# EAGLE design Loginator (EAGLE 6.2)
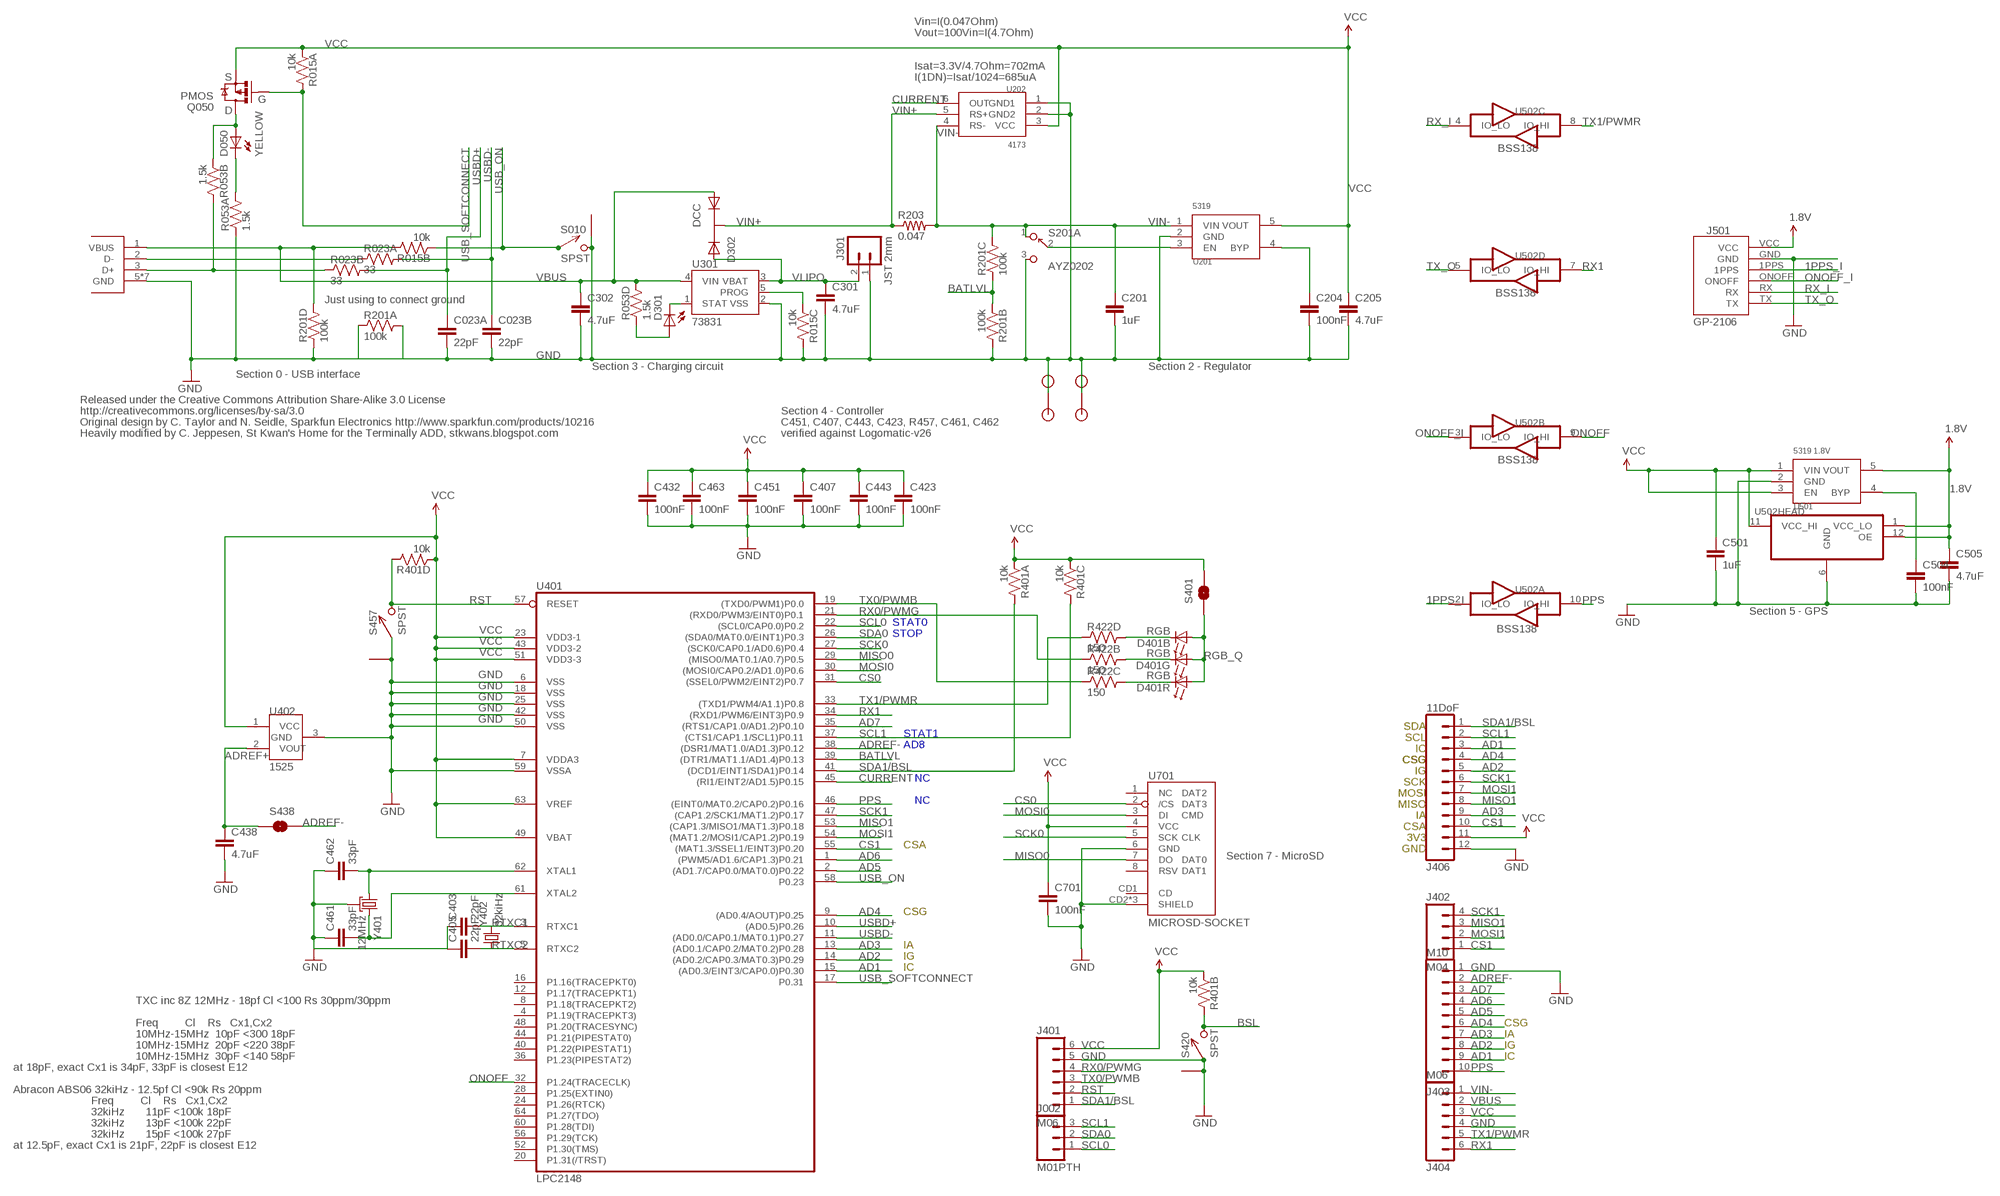
[diagram p0: schematic, sheet 1]

## Parts
C023  22pF  CKCM25  [CKCM25]
C201  1uF  CAP0402-CAP  [0402-CAP]
C204  100nF  CAP0402-CAP  [0402-CAP]
C205  4.7uF  CAP0402-CAP  [0402-CAP]
C301  4.7uF  CAP0402-CAP  [0402-CAP]
C302  4.7uF  CAP0402-CAP  [0402-CAP]
C403  22pF  CAP0402-CAP  [0402-CAP]
C405  22pF  CAP0402-CAP  [0402-CAP]
C407  100nF  CAP0402-CAP  [0402-CAP]
C423  100nF  CAP0402-CAP  [0402-CAP]
C432  100nF  CAP0402-CAP  [0402-CAP]
C438  4.7uF  CAP0402-CAP  [0402-CAP]
C443  100nF  CAP0402-CAP  [0402-CAP]
C451  100nF  CAP0402-CAP  [0402-CAP]
C461  33pF  CAP0402-CAP  [0402-CAP]
C462  33pF  CAP0402-CAP  [0402-CAP]
C463  100nF  CAP0402-CAP  [0402-CAP]
C501  1uF  CAP0402-CAP  [0402-CAP]
C504  100nF  CAP0402-CAP  [0402-CAP]
C505  4.7uF  CAP0402-CAP  [0402-CAP]
C701  100nF  CAP0402-CAP  [0402-CAP]
D050  YELLOW  LED0603  [LED-0603]
D301  BLUE  LED0603  [LED-0603]
D302  DCC  PMEG2005CT  [SOT-23-3]
D401  RGB  SMLP36RGB2W(R)  [SMLP36]
J001  USB_MICROB_JSTGCT  [USB_MICROB_3075]
J002  M01PTH  M03PTH  [1X03]
J301  JST 2mm  M02-JST-2MM-SMT  [JST-2-SMD]
J401  M06  M06SIP  [1X06]
J402  M04  M04PTH  [1X04]
J403  M10  M10"  [1X10]
J404  M06  M06SIP  [1X06]
J406  11DoF  M12PTH  [1X12]
J501  GP-2106  [GP-2106]
JP1  STANDOFF  [STANDOFF]
JP2  STANDOFF  [STANDOFF]
JP3  STANDOFF  [STANDOFF]
JP4  STANDOFF  [STANDOFF]
Q050  PMOS  MOSFET-PCHANNELSMD  [SOT23-3]
R015  10k  RP404  [CRA04]
R023  33  RP2EXB24V  [CRA02]
R053  1.5k  RP404  [CRA04]
R201  100k  RP404  [CRA04]
R203  0.047  RESISTOR0402-RES  [0402-RES]
R401  10k  RP404  [CRA04]
R422  150  RP404  [CRA04]
S010  SPST  B3U-1100P  [B3U-1100P]
S201  AYZ0202  [AYZ0202]
S401  SOLDERJUMPERNO  [SJ_2S-NO]
S420  SPST  B3U-1100P  [B3U-1100P]
S438  SOLDERJUMPERNO  [SJ_2S-NO]
S457  SPST  B3U-1100P  [B3U-1100P]
U201  5319  MIC5319D5  [SOT-23-5]
U202  4173  MAX4173  [SOT-23-6]
U301  73831  MCP73831  [SOT23-5]
U401  LPC2148  LPC213X  [SQFP-S-10X10-64]
U402  1525  MCP1525  [SOT-23-3]
U501  5319 1.8V  MIC5319D5  [SOT-23-5]
U502  TXB0104RUT  [R-PUQFN-N12]
U701  MICROSD-SOCKET  [MICROSD-SOCKET-PP]
Y401  12MHz  CX2520  [CRYSTAL_SMD_2MM_2_5MM]
Y402  32kiHz  ABS06  [ABS06]

## Nets
1.8V: C505.1 J501.VCC U501.5(VOUT) U502.1(HEAD:VCC_LO) U502.12(HEAD:OE)
1PPS_I: J501.1PPS U502.2(A:IO_LO)
AD1: J403.9 J406.3 U401.15((AD0.3/EINT3/CAP0.0)P0.30)
AD2: J403.8 J406.5 U401.14((AD0.2/CAP0.3/MAT0.3)P0.29)
AD3: J403.7 J406.9 U401.13((AD0.1/CAP0.2/MAT0.2)P0.28)
AD4: J403.6 J406.4 U401.9((AD0.4/AOUT)P0.25)
AD5: J403.5 U401.2((AD1.7/CAP0.0/MAT0.0)P0.22)
AD6: J403.4 U401.1((PWM5/AD1.6/CAP1.3)P0.21)
AD7: J403.3 U401.35((RTS1/CAP1.0/AD1.2)P0.10)
ADREF+: C438.1 S438.1 U402.2(VOUT)
ADREF-: J403.2 S438.2 U401.38((DSR1/MAT1.0/AD1.3)P0.12)
BATLVL: R201.2 R201.3 U401.39((DTR1/MAT1.1/AD1.4)P0.13)
BSL: R401.7 S420.P$2
CONN_D+: J001.3(D+) R023.2 R053.7
CONN_D-: J001.2(D-) R023.1
CS0: U401.31((SSEL0/PWM2/EINT2)P0.7) U701.2(/CS)
CS1: J402.1 J406.10 U401.55((MAT1.3/SSEL1/EINT3)P0.20)
CURRENT: U202.6(OUT) U401.45((RI1/EINT2/AD1.5)P0.15)
DB: D401.3(R:C) R422.6
DG: D401.5(G:C) R422.7
DR: D401.1(B:C) R422.5
EN: S201.2 U201.3(EN)
GND: C023.3 C023.4 C201.2 C204.2 C205.2 C301.2 C302.2 C403.1 C405.1 C407.2 C423.2 C432.2 C438.2 C443.2 C451.2 C461.1 C462.1 C463.2 C501.2 C504.2 C505.2 C701.2 J001.5(GND) J001.P$1(GND) J001.P$2(GND) J001.P$3(GND) J001.P$4(GND) J001.P$8(GND) J001.P$10(GND) J301.1 J401.5 J403.1 J404.4 J406.12 J501.GND JP1.P$1 JP2.P$1 JP3.P$1 JP4.P$1 R015.6 R053.1 R201.1 R201.4 R201.7 R201.8 S010.P$2 S010.P$3 S201.3 S420.P$1 S420.P$3 S457.P$1 S457.P$3 U201.2(GND) U202.1(GND1) U202.2(GND2) U301.2(VSS) U401.6(VSS) U401.18(VSS) U401.25(VSS) U401.42(VSS) U401.50(VSS) U401.59(VSSA) U402.3(GND) U501.2(GND) U502.6(HEAD:GND) U701.6(GND) U701.CD2(SHIELD) U701.GND1(SHIELD) U701.GND3(SHIELD) Y401.2(GND) Y401.4(GND)
MISO0: U401.29((MISO0/MAT0.1/A0.7)P0.5) U701.7(DO)
MISO1: J402.3 J406.8 U401.53((CAP1.3/MISO1/MAT1.3)P0.18)
MOSI0: U401.30((MOSI0/CAP0.2/AD1.0)P0.6) U701.3(DI)
MOSI1: J402.2 J406.7 U401.54((MAT1.2/MOSI1/CAP1.2)P0.19)
N$1: D301.A R053.4
N$2: R015.3 U301.5(PROG)
N$3: D301.C U301.1(STAT)
N$6: D050.A Q050.3(D) R053.2
N$7: D050.C R053.8
N$12: C504.1 U501.4(BYP)
N$17: C204.1 U201.4(BYP)
ONOFF: U401.32(P1.24(TRACECLK)) U502.9(B:IO_HI)
ONOFF_I: J501.ONOFF U502.3(B:IO_LO)
PPS: J403.10 U401.46((EINT0/MAT0.2/CAP0.2)P0.16) U502.10(A:IO_HI)
RGB_Q: D401.2(B:A) D401.4(R:A) D401.6(G:A) S401.1
RST: J401.2 R401.5 S457.P$2 U401.57(RESET)
RTXC1: C403.2 U401.3(RTXC1) Y402.2
RTXC2: C405.2 U401.5(RTXC2) Y402.1
RX0/PWMG: J401.4 R422.2 U401.21((RXD0/PWM3/EINT0)P0.1)
RX1: J404.6 U401.34((RXD1/PWM6/EINT3)P0.9) U502.7(D:IO_HI)
RX_I: J501.RX U502.4(C:IO_LO)
SCK0: U401.27((SCK0/CAP0.1/AD0.6)P0.4) U701.5(SCK)
SCK1: J402.4 J406.6 U401.47((CAP1.2/SCK1/MAT1.2)P0.17)
SCL0: J002.1 U401.22((SCL0/CAP0.0)P0.2)
SCL1: J002.3 J406.2 R401.6 U401.37((CTS1/CAP1.1/SCL1)P0.11)
SDA0: J002.2 U401.26((SDA0/MAT0.0/EINT1)P0.3)
SDA1/BSL: J401.1 J406.1 R401.8 U401.41((DCD1/EINT1/SDA1)P0.14)
TX0/PWMB: J401.3 R422.3 U401.19((TXD0/PWM1)P0.0)
TX1/PWMR: J404.5 R422.4 U401.33((TXD1/PWM4/A1.1)P0.8) U502.8(C:IO_HI)
TX_O: J501.TX U502.5(D:IO_LO)
USB_ON: R015.2 S010.P$1 U401.58(P0.23)
USB_SOFTCONNECT: Q050.1(G) R015.8 U401.17(P0.31)
USBD+: C023.1 R023.3 U401.10((AD0.5)P0.26)
USBD-: C023.2 R023.4 U401.11((AD0.0/CAP0.1/MAT0.1)P0.27)
VBUS [power]: C302.1 D302.1(A1) J001.1(VBUS) J404.2 R015.7 R053.5 R201.5 U301.4(VIN)
VCC: C205.1 C407.1 C423.1 C432.1 C443.1 C451.1 C463.1 C501.1 C701.1 J401.6 J404.3 J406.11 Q050.2(S) R015.1 R401.1 R401.2 R401.3 R401.4 S401.2 U201.5(VOUT) U202.3(VCC) U401.7(VDDA3) U401.23(VDD3-1) U401.43(VDD3-2) U401.49(VBAT) U401.51(VDD3-3) U401.63(VREF) U402.1(VCC) U501.1(VIN) U501.3(EN) U502.11(HEAD:VCC_HI) U701.4(VCC)
VIN+: D302.3(K) R203.1 U202.5(RS+)
VIN-: C201.1 J404.1 R201.6 R203.2 S201.1 U201.1(VIN) U202.4(RS-)
VLIPO [power]: C301.1 D302.2(A2) J301.2 U301.3(VBAT)
XTAL1: C462.2 U401.62(XTAL1) Y401.1
XTAL2: C461.2 U401.61(XTAL2) Y401.3
Unconnected: R015.4 R015.5 R053.3 R053.6 R422.1 R422.8 S201.4 S201.5 S201.6 U401.4(P1.19(TRACEPKT3)) U401.8(P1.18(TRACEPKT2)) U401.12(P1.17(TRACEPKT1)) U401.16(P1.16(TRACEPKT0)) U401.20(P1.31(/TRST)) U401.24(P1.26(RTCK)) U401.28(P1.25(EXTIN0)) U401.36(P1.23(PIPESTAT2)) U401.40(P1.22(PIPESTAT1)) U401.44(P1.21(PIPESTAT0)) U401.48(P1.20(TRACESYNC)) U401.52(P1.30(TMS)) U401.56(P1.29(TCK)) U401.60(P1.28(TDI)) U401.64(P1.27(TDO)) U701.1(NC) U701.8(RSV) U701.CD1(CD)

## Notes on the sheet
- Vin=I(0.047Ohm)
- Vout=100Vin=I(4.7Ohm)
- Isat=3.3V/4.7Ohm=702mA
- S | I(1DN)=Isat/1024=685uA
- G
- D
- BSS138
- BSS138
- Just using to connect ground
- Section 0 - USB interface | Section 3 - Charging circuit | Section 2 - Regulator
- Released under the Creative Commons Attribution Share-Alike 3.0 License
- http://creativecommons.org/licenses/by-sa/3.0 | Section 4 - Controller
- Original design by C. Taylor and N. Seidle, Sparkfun Electronics http://www.sparkfun.com/products/10216 | C451, C407, C443, C423, R457, C461, C462
- Heavily modified by C. Jeppesen, St Kwan's Home for the Terminally ADD, stkwans.blogspot.com | verified against Logomatic-v26
- BSS138
- Section 5 - GPS
- STAT0
- BSS138
- STOP
- SDA
- STAT1 | SCL
- AD8 | IC
- CSG | CSG
- IG
- NC | SCK
- MOSI
- NC | MISO
- IA
- CSA
- 3V3
- CSA | GND
- Section 7 - MicroSD
- CSG
- IA
- IG
- IC
- TXC inc 8Z 12MHz - 18pf Cl <100 Rs 30ppm/30ppm
- Freq         Cl    Rs   Cx1,Cx2 | CSG
- 10MHz-15MHz  10pF <300 18pF | IA
- 10MHz-15MHz  20pF <220 38pF | IG
- 10MHz-15MHz  30pF <140 58pF | IC
- at 18pF, exact Cx1 is 34pF, 33pF is closest E12
- Abracon ABS06 32kiHz - 12.5pf Cl <90k Rs 20ppm
- Freq         Cl    Rs   Cx1,Cx2
- 32kiHz       11pF <100k 18pF
- 32kiHz       13pF <100k 22pF
- 32kiHz       15pF <100k 27pF
- at 12.5pF, exact Cx1 is 21pF, 22pF is closest E12

## Library data of the parts
C023 = KwanSystems:CKC; DIGIKEY: 445-1860-1-ND
C201 C501 = SparkFun:CAP: Capacitor Standard 0603 ceramic capacitor, and 0.1" leaded capacitor.; DIGIKEY: 445-4114-1-ND
C204 C407 C423 C432 C443 C451 C463 C504 C701 = SparkFun:CAP: Capacitor Standard 0603 ceramic capacitor, and 0.1" leaded capacitor.; DIGIKEY: 445-1265-1-ND
C205 C301 C302 C438 C505 = SparkFun:CAP: Capacitor Standard 0603 ceramic capacitor, and 0.1" leaded capacitor.; DIGIKEY: 445-7395-1-ND
C403 C405 = SparkFun:CAP: Capacitor Standard 0603 ceramic capacitor, and 0.1" leaded capacitor.; DIGIKEY: 445-1239-1-ND
C461 C462 = SparkFun:CAP: Capacitor Standard 0603 ceramic capacitor, and 0.1" leaded capacitor.; DIGIKEY: 445-1241-1-ND
D050 = SparkFun:LED: LEDs Standard schematic elements and footprints for 5mm, 3mm, 1206, and 0603 sized LEDs. 5mm - Spark Fun Electronics SKU : COM-00529 (and others); DIGIKEY: 350-2032-1-ND
D301 = SparkFun:LED: LEDs Standard schematic elements and footprints for 5mm, 3mm, 1206, and 0603 sized LEDs. 5mm - Spark Fun Electronics SKU : COM-00529 (and others); DIGIKEY: 350-2037-1-ND
D302 = KwanSystems:PMEG2005CT; DIGIKEY: 568-6500-1-ND
D401 = KwanSystems:SMLP36RGB2W(R); DIGIKEY: 846-1097-1-ND
J001 = KwanSystems:USB_MICROB_JST; DIGIKEY: 609-4616-2-ND
J002 = SparkFun:M03: Header 3 Standard 3-pin 0.1" header. Use with straight break away headers (SKU : PRT-00116), right angle break away headers (PRT-00553), swiss pins (PRT-00743), machine pins (PRT-00117), and female headers (PRT-00115). Molex polarized connector foot print use with SKU : PRT-08232 with associated crimp pins and housings.; DIGIKEY: $NOPART
J301 = SparkFun:M02: Header 2 Standard 2-pin 0.1" header. Use with straight break away headers (SKU : PRT-00116), right angle break away headers (PRT-00553), swiss pins (PRT-00743), machine pins (PRT-00117), and female headers (PRT-00115). Molex polarized connector foot print use with SKU : PRT-08233 with associated crimp pins and housings.; DIGIKEY: 455-1749-1-ND
J401 J404 = SparkFun:M06: Header 6 Standard 6-pin 0.1" header. Use with straight break away headers (SKU : PRT-00116), right angle break away headers (PRT-00553), swiss pins (PRT-00743), machine pins (PRT-00117), and female headers (PRT-00115). Molex polarized connector foot print use with SKU : PRT-08094 with associated crimp pins and housings. NOTES ON THE VARIANTS LOCK and LOCK_LONGPADS... This footprint was designed to help hold the alignment of a through-hole component (i.e. 6-pin header) while soldering it into place. You may notice that each hole has been shifted either up or down by 0.005 of an inch from it's more standard position (which is a perfectly straight line). This slight alteration caused the pins (the squares in the middle) to touch the edges of the holes. Because they are alternating, it causes a "brace" to hold the component in place. 0.005 has proven to be the perfect amount of "off-center" position when using our standard breakaway headers. Although looks a little odd when you look at the bare footprint, once you have a header in there, the alteration is very hard to notice. Also, if you push a header all the way into place, it is covered up entirely on the bottom side. This idea of altering the position of holes to aid alignment will be further integrated into the Sparkfun Library for other footprints. It can help hold any component with 3 or more connection pins.; DIGIKEY: $NOPART
J402 = SparkFun:M04: Header 4 Standard 4-pin 0.1" header. Use with straight break away headers (SKU : PRT-00116), right angle break away headers (PRT-00553), swiss pins (PRT-00743), machine pins (PRT-00117), and female headers (PRT-00115). Molex polarized connector foot print use with SKU : PRT-08231 with associated crimp pins and housings. 1MM SMD Version SKU: PRT-10208; DIGIKEY: $NOPART
J403 = SparkFun:M10: Header 10 Standard 10-pin 0.1" header. Use with straight break away headers (SKU : PRT-00116), right angle break away headers (PRT-00553), swiss pins (PRT-00743), machine pins (PRT-00117), and female headers (PRT-00115).; DIGIKEY: $NOPART
J406 = SparkFun:M12: Header 12 Standard 12-pin 0.1" header. Use with straight break away headers (SKU : PRT-00116), right angle break away headers (PRT-00553), swiss pins (PRT-00743), machine pins (PRT-00117), and female headers (PRT-00115).; DIGIKEY: $NOPART
J501 = SparkFun:GP-2106: GP-2106 GPS SiRF IV; DIGIKEY: FH34SRJ-6S-0.5SH(99)-ND
JP1-JP4 = KwanSystems:STANDOFF; DIGIKEY: $NOPART
Q050 = SparkFun:MOSFET-PCHANNEL; DIGIKEY: NTR1P02T1GOSCT-ND
R015 R401 = KwanSystems:RP4; DIGIKEY: CRA4S810KCT-ND
R023 = KwanSystems:RP2; DIGIKEY: Y5330CT-ND
R053 = KwanSystems:RP4; DIGIKEY: CRA4S81.5KCT-ND
R201 = KwanSystems:RP4; DIGIKEY: CRA4S8100KCT-ND
R203 = SparkFun:RESISTOR: Resistor Basic schematic elements and footprints for 0603, 1206, and PTH resistors.; DIGIKEY: P.047ATCT-ND
R422 = KwanSystems:RP4; DIGIKEY: CRA4P8150CT-ND
S010 S420 S457 = KwanSystems:B3U-1100P; DIGIKEY: SW1021CT-ND
S201 = KwanSystems:AYZ0202; DIGIKEY: 401-2013-1-ND
S401 S438 = SparkFun:SOLDERJUMPER: Solder Jumper Standard SMD solder jumper. Used to automate production. Two varients : Normally Open and Normally Closed are the same, but have different paste layers. NC will have a large amount of paste and should jumper during reflow.; DIGIKEY: $NOPART
U201 = KwanSystems:MIC5319; DIGIKEY: 576-1910-1-ND
U202 = KwanSystems:MAX4173; DIGIKEY: MAX4173HEUT+TCT-ND
U301 = SparkFun:MCP73831: Microchip's MCP73831 Miniature single cell, fully integrated Li-Ion, Li-polymer charge management controller http://ww1.microchip.com/downloads/en/DeviceDoc/21984a.pdf; DIGIKEY: MCP73831T-2ACI/OTCT-ND
U401 = SparkFun:LPC213X: LPC213x Schematic element and footprint for NXP LPC213x. Spark Fun Electronics SKU : COM-00520; DIGIKEY: 568-1765-ND
U402 = KwanSystems:MCP1525; DIGIKEY: MCP1525T-I/TTCT-ND
U501 = KwanSystems:MIC5319; DIGIKEY: 576-2864-1-ND
U502 = KwanSystems:TXB0104; DIGIKEY: 296-25888-1-ND
U701 = KwanSystems:MICROSD-SOCKET: microSD Socket Push-push type uSD socket. Digikey 101-00660-68-6-1-ND. tDoc lines correctly indicate media card edge positions when inserting (unlocked, locked, depressed).; DIGIKEY: 101-00581-59-1-ND
Y401 = KwanSystems:CX2520; DIGIKEY: 887-1487-1-ND; LABEL_3D50: 12M
Y402 = KwanSystems:ABS06; DIGIKEY: 535-10104-1-ND

## Net classes
0 default: width 0.152 mm, drill 0.33 mm, clearance 0.152 mm
1 power: width 0.152 mm, drill 0.33 mm, clearance 0.152 mm to class 0, clearance 0.152 mm
2 hv: width 0.152 mm, drill 0.33 mm, clearance 0.152 mm to class 0, clearance 0.152 mm to class 1, clearance 0.152 mm

## Board
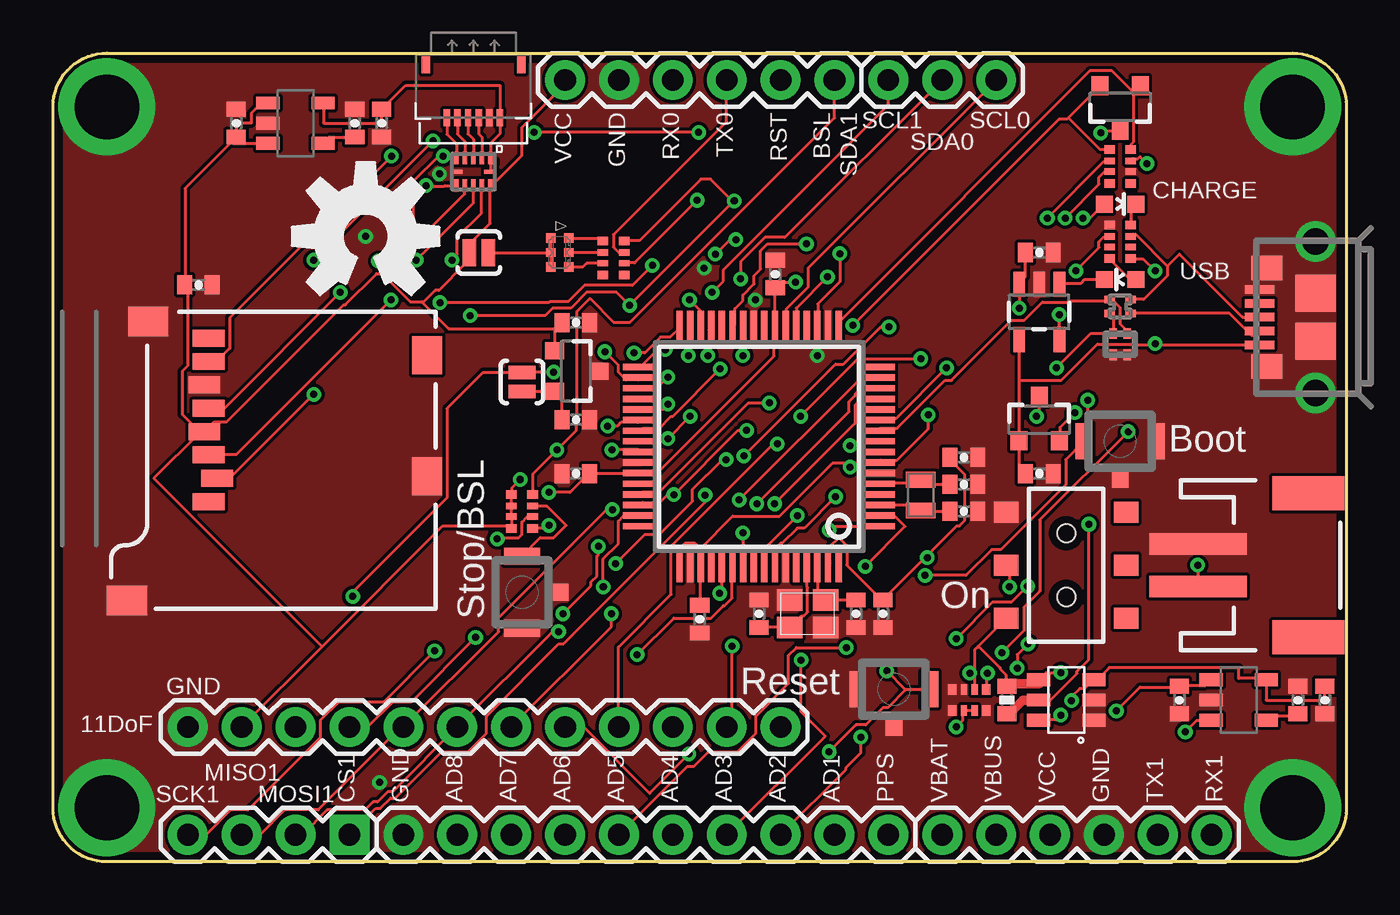
[diagram p1: board, top side]
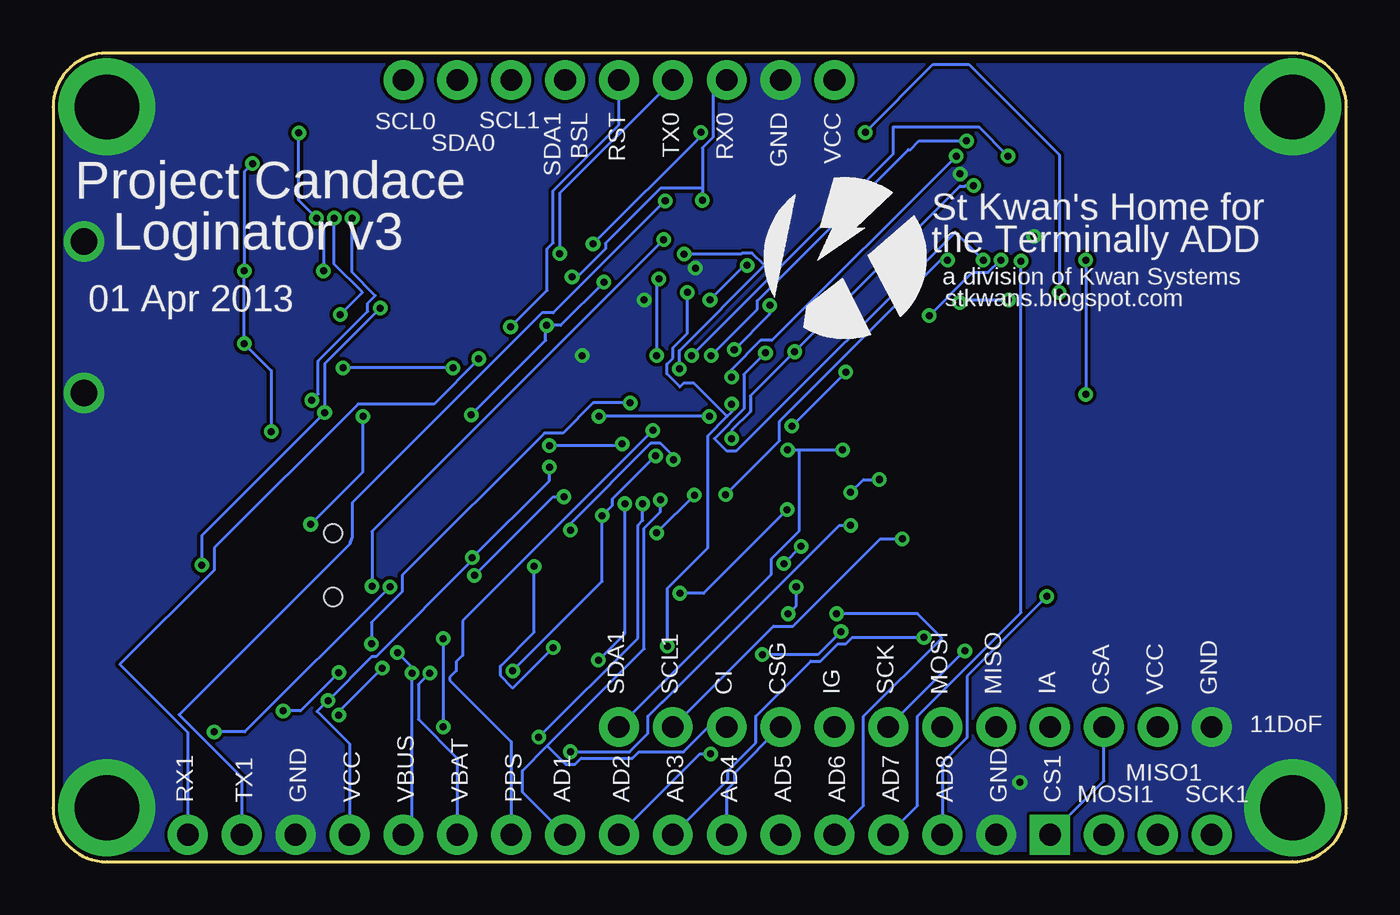
[diagram p2: board, bottom side, seen from below]

Size 60.96 x 38.1 mm. Coordinates in mm from the lower left corner, seen from the top.
Outline: 2.54,38.1 58.42,38.1 arc-90 60.96,35.56 60.96,2.54 arc-90 58.42,0 2.54,0 arc-90 0,2.54 0,35.56 arc-90 2.54,38.1
Copper layers (1*16): Top 0.0356mm / dielectric 1.5011mm / Bottom 0.0356mm
Design rules: minimum track width 6mil, minimum drill 13mil, track to track 6mil, track to pad 6mil, pad to pad 6mil, via to via 6mil, smd to smd 6mil, copper to edge 15mil, drill to drill 6mil, minimum pad ring 7mil, minimum via ring 7mil, stop-mask expansion 4mil, vias tented up to drill 14mil, thermal gap 10mil
vRestrict: area 4.8,2.8 to 7.6,3.6; area 7.1,3.8 to 10.4,4.6; area 9.4,2.8 to 13,3.6; area 13.2,2.8 to 14.5,4.8; area 15.7,2.8 to 17,4.8; area 18.3,2.8 to 19.6,4.8; area 20.8,2.8 to 22.1,4.8; area 23.4,2.8 to 24.6,4.8; area 25.9,2.8 to 27.2,4.8; area 28.4,2.8 to 29.7,4.8; area 31,2.8 to 32.3,4.8; area 33.5,2.8 to 34.8,4.8; 44 more areas

### Footprints (pad centres in the part's own frame; a part is rotated, then mirrored left to right if it is on the bottom)
CKCM25 = smd 0.35 x 0.5: 1 -0.325,-0.5; 2 0.325,-0.5; 3 0.325,0.5; 4 -0.325,0.5
0402-CAP = smd 0.7 x 0.9: 1 -0.65,0; 2 0.65,0
LED-0603 = smd 0.8 x 0.8: A 0,-0.75; C 0,0.75
SOT-23-3 = smd 0.9 x 0.8: 1 -1,0.95; 2 -1,-0.95; 3 1.1,0
SMLP36 = smd 0.45 x 0.45: 1 -0.675,0.425; 2 -0.675,-0.425; 5 0.675,0.425; 6 0.675,-0.425 | smd 0.4 x 0.45: 3 0,0.425; 4 0,-0.425
USB_MICROB_3075 = smd 0.4 x 1.4: 1 -1.3,4.1; 2 -0.65,4.1; 3 0,4.1; 4 0.65,4.1; 5 1.3,4.1 | smd 1.15 x 1.45: P$1 2.32,3.75; P$10 -2.32,3.75 | smd 1.75 x 1.9: P$2 1.125,1.45; P$8 -1.125,1.45 | drill 1.25 pad 1.9: P$3 -3.575,1.45; P$4 3.575,1.45
1X03 = drill 1.016 pad 1.88: 1 0,0; 2 2.54,0; 3 5.08,0
JST-2-SMD = smd 1 x 4.6: 1 -1,-3.7; 2 1,-3.7 | smd 1.6 x 3.4: NC1 -3.4,1.5; NC2 3.4,1.5
1X06 = drill 1.016 pad 1.88: 1 0,0; 2 2.54,0; 3 5.08,0; 4 7.62,0; 5 10.16,0; 6 12.7,0
1X04 = drill 1.016 pad 1.88 square: 1 0,0 | drill 1.016 pad 1.88: 2 2.54,0; 3 5.08,0; 4 7.62,0
1X10 = drill 1.016 pad 1.88: 1 0,0; 2 2.54,0; 3 5.08,0; 4 7.62,0; 5 10.16,0; 6 12.7,0; 7 15.24,0; 8 17.78,0; 9 20.32,0; 10 22.86,0
1X12 = drill 1.016 pad 1.88: 1 0,0; 2 2.54,0; 3 5.08,0; 4 7.62,0; 5 10.16,0; 6 12.7,0; 7 15.24,0; 8 17.78,0; 9 20.32,0; 10 22.86,0; 11 25.4,0; 12 27.94,0
GP-2106 = smd 0.3 x 0.8: 1PPS -0.25,0; GND -0.75,0; ONOFF 0.25,0; RX 0.75,0; TX 1.25,0; VCC -1.25,0 | smd 0.4 x 0.8: P$7 -2.25,-2.5; P$8 2.25,-2.5
STANDOFF = drill 3.048 pad 4.572: P$1 0,0
SOT23-3 = smd 0.8 x 0.9: 1 -0.95,-1; 2 0.95,-1; 3 0,1.1
CRA04 = smd 0.4 x 0.5: 1 -0.8,-0.5; 4 0.8,-0.5; 5 0.8,0.5; 8 -0.8,0.5 | smd 0.3 x 0.5: 2 -0.25,-0.5; 3 0.25,-0.5; 6 0.25,0.5; 7 -0.25,0.5
CRA02 = smd 0.35 x 0.5: 1 -0.325,-0.5; 2 0.325,-0.5; 3 0.325,0.5; 4 -0.325,0.5
0402-RES = smd 0.7 x 0.9: 1 -0.65,0; 2 0.65,0
B3U-1100P = smd 0.8 x 1.7: P$1 -1.7,0; P$2 1.7,0 | smd 0.8 x 1.1: P$3 0,-1.65
AYZ0202 = smd 1 x 1.15: 1 -2.5,2.825; 2 0,2.825; 3 2.5,2.825; 4 -2.5,-2.825; 5 0,-2.825; 6 2.5,-2.825 | hole 0.85: 1.5,0; -1.5,0
SJ_2S-NO = smd 0.635 x 1.27: 1 -0.45,0; 2 0.45,0
SOT-23-5 = smd 0.6 x 1.1: 1 -0.95,-1.3; 2 0,-1.3; 3 0.95,-1.3; 4 0.95,1.3; 5 -0.95,1.3
SOT-23-6 = smd 0.6 x 1.1: 1 -0.95,-1.3; 2 0,-1.3; 3 0.95,-1.3; 4 0.95,1.3; 5 0,1.3; 6 -0.95,1.3
SOT23-5 = smd 0.55 x 1.2: 1 -0.95,-1.3; 2 0,-1.3; 3 0.95,-1.3; 4 0.95,1.3; 5 -0.95,1.3
SQFP-S-10X10-64 = smd 0.3 x 1.6: 1 -3.75,-5.6; 2 -3.25,-5.6; 3 -2.75,-5.6; 4 -2.25,-5.6; 5 -1.75,-5.6; 6 -1.25,-5.6; 7 -0.75,-5.6; 8 -0.25,-5.6; 9 0.25,-5.6; 10 0.75,-5.6; 11 1.25,-5.6; 12 1.75,-5.6; 13 2.25,-5.6; 14 2.75,-5.6; 15 3.25,-5.6; 16 3.75,-5.6; 33 3.75,5.6; 34 3.25,5.6; 35 2.75,5.6; 36 2.25,5.6; 37 1.75,5.6; 38 1.25,5.6; 39 0.75,5.6; 40 0.25,5.6; 41 -0.25,5.6; 42 -0.75,5.6; 43 -1.25,5.6; 44 -1.75,5.6; 45 -2.25,5.6; 46 -2.75,5.6; 47 -3.25,5.6; 48 -3.75,5.6 | smd 1.6 x 0.3: 17 5.6,-3.75; 18 5.6,-3.25; 19 5.6,-2.75; 20 5.6,-2.25; 21 5.6,-1.75; 22 5.6,-1.25; 23 5.6,-0.75; 24 5.6,-0.25; 25 5.6,0.25; 26 5.6,0.75; 27 5.6,1.25; 28 5.6,1.75; 29 5.6,2.25; 30 5.6,2.75; 31 5.6,3.25; 32 5.6,3.75; 49 -5.6,3.75; 50 -5.6,3.25; 51 -5.6,2.75; 52 -5.6,2.25; 53 -5.6,1.75; 54 -5.6,1.25; 55 -5.6,0.75; 56 -5.6,0.25; 57 -5.6,-0.25; 58 -5.6,-0.75; 59 -5.6,-1.25; 60 -5.6,-1.75; 61 -5.6,-2.25; 62 -5.6,-2.75; 63 -5.6,-3.25; 64 -5.6,-3.75
R-PUQFN-N12 = smd 0.2 x 0.6: 1 -0.8,-0.65; 2 -0.4,-0.65; 3 0,-0.65; 4 0.4,-0.65; 5 0.8,-0.65; 7 0.8,0.65; 8 0.4,0.65; 9 0,0.65; 10 -0.4,0.65; 11 -0.8,0.65 | smd 0.6 x 0.2: 6 0.8,0; 12 -0.8,0
MICROSD-SOCKET-PP = smd 0.8 x 1.5: 1 -8.94,10.7; 2 -7.84,10.3; 3 -6.74,10.7; 4 -5.64,10.9; 5 -4.54,10.7; 6 -3.44,10.9; 7 -2.34,10.7; 8 -1.24,10.7 | smd 1.8 x 1.4: CD1 -2.05,0.4; CD2 -7.75,0.4 | smd 1.4 x 1.9: GND1 -13.6,14.55; GND3 -0.45,13.55
CRYSTAL_SMD_2MM_2_5MM = smd 1.2 x 1: 1 -0.85,-0.65; 2 0.85,-0.65; 3 0.85,0.65; 4 -0.85,0.65
ABS06 = smd 0.75 x 1.4: 1 -0.725,0; 2 0.725,0

### Placement (x,y rotation side)
C023  50.29,24.38 180 top
C201  53.09,7.62 270 top
C204  58.67,7.62 90 top
C205  59.94,7.62 270 top
C301  46.48,28.7 0 top
C302  46.48,18.29 0 top
C403  42.93,16.51 180 top
C405  42.93,17.78 180 top
C407  42.93,19.05 0 top
C423  34.04,27.69 90 top
C432  24.64,25.4 0 top
C438  24.64,20.83 0 top
C443  24.64,18.29 180 top
C451  30.48,11.43 270 top
C461  33.27,11.68 270 top
C462  37.85,11.68 90 top
C463  39.12,11.68 270 top
C501  8.64,34.8 90 top
C504  14.22,34.8 90 top
C505  15.49,34.8 270 top
C701  6.86,27.18 0 top
D050  50.29,30.99 270 top
D301  50.29,27.43 90 top
D302  46.48,20.83 90 top
D401  23.88,28.7 270 top
J001  60.96,25.65 90 top
J002  44.45,36.83 180 top
J301  57.66,13.97 270 top
J401  36.83,36.83 180 top
J402  13.97,1.27 180 top
J403  16.51,1.27 0 top
J404  41.91,1.27 0 top
J406  34.29,6.35 180 top
J501  19.81,35.05 180 top
JP1  2.54,2.54 0 top
JP2  58.42,2.54 0 top
JP3  2.54,35.56 0 top
JP4  58.42,35.56 0 top
Q050  50.29,35.56 180 top
R015  50.29,32.77 270 top
R023  50.29,26.16 90 top
R053  50.29,29.21 270 top
R201  43.18,7.62 0 top
R203  44.96,7.62 90 top
R401  22.1,16.51 270 top
R422  26.42,28.45 90 top
S010  50.29,19.81 0 top
S201  47.75,13.97 90 top
S401  20.07,28.7 180 top
S420  22.1,12.7 90 top
S438  22.1,22.61 90 top
S457  39.62,8.13 0 top
U201  55.88,7.62 270 top
U202  47.75,7.62 90 top
U301  46.48,25.91 180 top
U401  33.27,19.56 90 top
U402  24.64,23.11 0 top
U501  11.43,34.8 270 top
U502  19.81,32.51 180 top
U701  18.03,25.91 90 top
U$1  [KWAN_CIRCLE]  23.62,28.45 0 bottom
U$2  [OSHW-LOGO-L]  14.73,29.46 0 top
Y401  35.56,11.68 180 top
Y402  40.89,17.27 270 top

### Tracks (layer width: path | path; a pad name or v marks a point on that pad's centre or on a via)
1.8V
  Top 0.152: U502.12 20.62,32.51 20.62,33.15 U502.1 20.61,33.84 21.06,34.29 J501.VCC 21.06,36.58 16.62,36.58 C505.1 | C505.1 | U501.5 12.75,35.76 12.75,34.8 15.49,34.8 C505.1
1PPS_I
  Top 0.152: J501.1PPS 20.06,34.29 20.07,34.29 20.21,34.14 U502.2
AD1  (via drill 0.33)
  Top 0.152: v32.33,17.04 38.08,22.78 38.86,22.78 U401.15
  Bottom 0.152: v32.33,17.04 32.33,16.48 33.1,15.72 33.1,10.03 37.67,5.46 | 37.67,5.46 38.84,4.29 38.84,3.28 J403.9 | J406.3 30.07,6.35 31.24,5.18 33.35,5.18 33.66,4.88 36.07,4.88 36.35,4.6 36.8,4.6 37.67,5.46
AD2  (via drill 0.33)
  Top 0.152: v33.17,16.87 37.52,21.21 37.52,21.67 37.82,21.97 37.82,22.05 38.08,22.3 U401.14 | v38.08,5.87 38.08,5.13 37.36,4.42 37.36,4.34 J403.8 | J406.5 24.99,6.35 28.12,3.23 v29.97,5.08
  Bottom 0.152: v33.17,16.87 33.17,16.08 33.4,15.85 33.4,10.54 v38.08,5.87 | v29.97,5.08 30.48,5.08 J403.8
AD3  (via drill 0.33)
  Top 0.152: v34.01,16.87 37.82,20.68 37.82,21.54 38.08,21.79 38.86,21.79 U401.13 | v35.26,9.5 35.26,7.06 36.4,5.92 J403.7 | J406.9 14.83,6.35 16,7.52 16.87,7.52 v19.91,10.57
  Bottom 0.152: v34.01,16.87 34.01,10.74 v35.26,9.5 | v19.91,10.57 23.29,10.57 23.6,10.26 23.98,10.26 24.79,9.45 25.25,9.45 27.84,6.86 27.84,5.61 29.16,4.29 29.16,3.86 J403.7
AD4  (via drill 0.33)
  Top 0.152: v37.57,19.61 37.74,19.79 38.86,19.79 U401.9 | v34.14,19.68 33.96,19.68 29.13,14.86 29.13,12.6 26.64,10.11 26.64,6.38 J406.4
  Bottom 0.152: v37.57,19.61 34.21,19.61 v34.14,19.68 | J403.6 29.21,3.38 28.85,3.73 28.85,4.17 J406.4
AD5  (via drill 0.33)
  Top 0.152: v38.28,13.92 40.16,15.8 39.65,16.31 38.89,16.31 U401.2 | v37.39,10.08 35.03,10.08 34.67,9.73 34.67,8.41 33.12,6.86 33.12,6.04 32.26,5.18 30.89,5.18 30.2,4.5 29.9,4.5 J403.5
  Bottom 0.152: v38.28,13.92 38.28,10.82 39.88,9.22 39.88,8.76 39.29,8.18 v37.39,10.08
AD6  (via drill 0.33)
  Top 0.152: v36.58,15.62 36.75,15.8 38.86,15.8 U401.1 | v31.73,18.95 31.55,18.95 30.15,17.55 30.15,16.99 28.57,15.42 27.89,15.42 v26.52,14.05 | v25.7,14.86 25.7,14.48 25.63,14.4 25.63,13.46 25.35,13.18 25.35,13.01 v24.03,11.68
  Bottom 0.152: v36.58,15.62 36.58,15.93 32.79,19.71 32.33,19.71 31.65,19.02 v31.73,18.95 | v25.7,14.86 v26.52,14.05 | v24.03,11.68 20.22,11.68 19.07,10.54 22.76,6.86 22.76,2.64 J403.4
AD7  (via drill 0.33)
  Top 0.152: v28.98,22.84 28.47,22.33 27.69,22.33 U401.35 | v18.39,33.25 18.16,33.25 16.99,32.08 16.99,29.95 v15.34,28.3
  Bottom 0.152: v28.98,22.84 28.98,23.19 27.61,24.56 27.08,24.56 v18.39,33.25 | v15.34,28.3 15.34,11.73 20.22,6.86 20.22,2.64 J403.3
ADREF+
  Top 0.152: S438.1 22.1,22.17 23.62,22.17 U402.2 23.67,22.1 23.98,21.79 23.98,20.83 C438.1
ADREF-  (via drill 0.33)
  Top 0.152: v23.6,23.06 S438.2 | v26.14,20.52 26.59,20.52 26.77,20.7 27.56,20.7 U401.38 | v14.12,12.5 14.12,12.7 18.57,17.14 18.57,21.36 20.26,23.06 S438.2 | 22.05,23.01 S438.2
  Bottom 0.152: v26.14,20.52 v23.6,23.06 | J403.2 19.05,4.67 17.88,5.84 17.88,8.74 v14.12,12.5
BATLVL  (via drill 0.33)
  Top 0.152: R201.3 43.41,7.11 42.95,7.11 R201.2 42.88,7.06 42.88,6.66 v42.57,6.35 | v42.57,10.52 44.27,12.22 45.16,12.22 v45.92,12.98 | v32.18,29.31 31.9,29.31 v31.22,28.63 | v31.45,23.22 29.21,20.98 29.13,20.98 28.57,20.42 27.79,20.42 U401.39
  Bottom 0.152: v42.57,10.52 v42.57,6.35 | v45.92,12.98 45.92,15.57 v32.18,29.31 | v31.22,28.63 28.52,28.63 28.47,28.68 28.02,28.68 27.43,28.09 31.45,24.08 v31.45,23.22
BSL
  Top 0.152: R401.7 22.61,16.74 23.29,16.74 24.18,15.85 23.6,15.27 22.96,15.27 S420.P$2
CONN_D+
  Top 0.152: 52.53,28.07 52.53,27.61 51.41,26.49 R023.2 | 52.53,28.07 51.03,29.57 50.9,29.57 R053.7 | J001.3 56.06,25.65 53.09,28.63 52.53,28.07
CONN_D-
  Top 0.152: R023.1 55.45,25.83 56.49,24.79 56.64,24.79 56.84,24.99 J001.2
CS0  (via drill 0.33)
  Top 0.152: v12.29,22.02 8.36,18.09 7.75,18.09 U701.2 | v17.91,33.96 v12.29,28.35 | v29.95,23.85 29.95,25.07 30.02,25.15 U401.31
  Bottom 0.152: v12.29,28.35 v12.29,22.02 | v17.91,33.96 20.14,33.96 20.55,33.55 20.65,33.55 27.76,26.44 27.76,26.04 v29.95,23.85
CS1  (via drill 0.33)
  Top 0.152: v32.51,15.49 U401.55 | v30.73,17.27 30.73,16.94 24.05,10.26 23.82,10.26 20.42,6.86 20.42,6.04 19.56,5.18 18.31,5.18 16.13,3 15.9,3 15.42,2.52 15.21,2.52 J402.1
  Bottom 0.152: v30.73,17.27 v32.51,15.49 | J406.10 11.43,3.81 J402.1
CURRENT  (via drill 0.33)
  Top 0.152: v47.5,6.91 47.27,6.68 U202.6 | v45.44,9.12 45.44,9.75 v45.95,10.26 | v33.76,21.61 32.77,21.61 28.57,17.42 27.79,17.42 27.69,17.32 U401.45
  Bottom 0.152: v47.5,6.91 47.5,7.06 v45.44,9.12 | v45.95,10.26 45.95,11.28 44.5,12.72 44.5,13.49 37.8,20.19 36.93,20.19 35.51,21.61 v33.76,21.61
DB
  Top 0.152: D401.3 25.91,28.7 R422.6
DG
  Top 0.152: 24.31,28.04 D401.5 24.98,28.03 25.15,28.19 25.91,28.19 R422.7
DR
  Top 0.152: D401.1 24.31,29.36 25.81,29.36 25.91,29.26 R422.5
EN  (via drill 0.33)
  Top 0.152: v53.37,6.12 53.9,6.66 54.56,6.66 U201.3 | v45.09,12.95 45.09,13.82 S201.2
  Bottom 0.152: v53.37,6.12 51.92,6.12 v45.09,12.95
GND  (via drill 0.33)
  other vias: 15.39,3.73 18.21,32.41 33.1,26.47 30.68,27.97 36.02,23.85 14.73,29.46
  pour Top (no thermals): 2.54,38.1 58.42,38.1 arc-90 60.96,35.56 60.96,2.54 arc-90 58.42,0 2.54,0 arc-90 0,2.54 0,35.56 arc-90
  pour Bottom (no thermals): 2.54,38.1 58.42,38.1 arc-90 60.96,35.56 60.96,2.54 arc-90 58.42,0 2.54,0 arc-90 0,2.54 0,35.56 arc-90
MISO0  (via drill 0.33)
  Top 0.152: v15.95,33.25 8.33,25.63 8.33,24.18 7.72,23.57 U701.7 | v30.86,23.85 30.86,24.21 30.91,24.26 30.91,25.04 31.01,25.15 U401.29
  Bottom 0.152: v30.86,23.85 21.36,33.35 21.36,34.62 17.32,34.62 v15.95,33.25
MISO1  (via drill 0.33)
  Top 0.152: v31.42,12.65 31.52,12.75 31.52,13.95 U401.53 | v26.36,16.59 26.09,16.59 21.01,11.51 21.01,10.85 J406.8 16.46,6.4 12.5,2.44 10.92,2.44 9.75,1.27 J402.3
  Bottom 0.152: v31.42,12.65 30.3,12.65 v26.36,16.59
MOSI0  (via drill 0.33)
  Top 0.152: v15.93,26.47 8.64,19.18 U701.3 | v18.24,26.34 23.37,26.34 23.42,26.39 24.28,26.39 25.04,27.15 27.3,27.15 v28.25,28.09 | v30,26.47 30.63,25.83 30.63,25.27 U401.30
  Bottom 0.152: v15.93,26.47 18.11,26.47 v18.24,26.34 | v28.25,28.09 28.37,28.09 v30,26.47
MOSI1  (via drill 0.33)
  Top 0.152: v27.53,9.75 29.26,11.48 31.01,11.48 31.6,12.06 31.65,12.06 32,12.42 32,13.95 U401.54 | v23.82,10.85 23.55,10.85 J406.7 16,3.3 15.77,3.3 15.29,2.82 15.09,2.82 14.71,2.44 12.93,2.44 11.76,1.27 J402.2
  Bottom 0.152: v27.53,9.75 24.92,9.75 v23.82,10.85
N$1
  Top 0.152: R053.4 49.81,28.4 50.9,27.3 D301.A
N$2  (via drill 0.33)
  Top 0.152: v47.7,30.33 49.3,31.93 49.3,32.26 49.55,32.51 R015.3 | v47.42,25.78 U301.5
  Bottom 0.152: v47.7,30.33 47.7,28.14 46.38,26.82 v47.42,25.78
N$3
  Top 0.152: D301.C 48.62,27.43 48.44,27.25 47.47,27.25 47.45,27.23 U301.1
N$6  (via drill 0.33)
  Top 0.152: v48.21,27.84 49.3,28.93 49.3,29.21 49.53,29.44 49.78,29.44 R053.2 | v48.54,30.33 48.87,30.33 D050.A | v49.38,34.34 49.48,34.44 50.29,34.44 Q050.3
  Bottom 0.152: v48.21,27.84 48.21,30 v48.54,30.33 49.38,31.17 v49.38,34.34
N$7
  Top 0.152: R053.8 50.8,30.02 50.8,30.76 D050.C
N$12
  Top 0.152: C504.1 14.22,34.14 13.03,34.14 12.75,33.86 U501.4
N$17
  Top 0.152: C204.1 58.56,6.86 57.66,6.86 57.47,6.67 U201.4
ONOFF  (via drill 0.33)
  Top 0.152: U502.9 19.81,31.04 v17.12,28.35 | v27.38,23.98 27.89,23.98 28.63,24.71 29.08,24.71 29.52,25.15 U401.32
  Bottom 0.152: v17.12,28.35 18.44,29.67 28.75,19.36 29.21,19.36 29.79,19.94 28.4,21.34 28.4,22.96 v27.38,23.98
ONOFF_I
  Top 0.152: J501.ONOFF 19.56,34.29 19.81,34.04 U502.3
PPS  (via drill 0.33)
  Top 0.152: v18.8,28.35 19.05,28.6 19.05,29.41 20.19,30.56 20.19,31.85 U502.10 | U401.46 27.69,16.82 27.79,16.92 28.57,16.92 28.96,17.3 v29.26,17.3 32.28,20.32 v32.69,20.32
  Bottom 0.152: v18.8,28.35 19.13,28.35 26.72,20.75 26.72,19.84 v29.26,17.3 | J403.10 39.37,5.66 42.27,8.56 42.27,8.69 41.96,8.99 41.96,9.42 41.66,9.73 41.66,11.35 v32.69,20.32
RGB_Q
  Top 0.152: D401.6 23.47,28.04 23.47,28.7 D401.4 | D401.2 23.47,29.36 23.47,28.75 D401.4 | S401.1 D401.4
RST  (via drill 0.33)
  Top 0.152: v23.37,15.85 23.24,15.72 22.61,15.72 R401.5 | v36.58,5.18 37.85,6.45 38.3,6.45 39.12,7.26 39.34,7.26 40.18,8.1 | 40.18,8.1 41.27,8.1 41.3,8.13 S457.P$2 | v35.08,16.31 33.53,14.76 U401.57 | 40.18,8.1 v39.29,8.99 | v39.4,25.2 39.01,25.2 37.26,23.44 36.88,23.44 v32.56,19.13
  Bottom 0.152: v23.37,15.85 23.9,15.85 32.23,7.52 32.26,7.52 32.92,6.86 32.92,6.04 33.78,5.18 v36.58,5.18 | v39.29,8.99 35.08,13.21 v35.08,16.31 34.59,16.79 34.59,17.09 v32.56,19.13 | J401.2 34.29,34.72 37.39,31.62 37.39,29.16 37.67,28.88 37.67,26.92 v39.4,25.2
RTXC1
  Top 0.152: C403.2 40.92,16.51 40.89,16.54 Y402.2 40.84,16.59 40.64,16.79 38.89,16.79 U401.3
RTXC2
  Top 0.152: C405.2 41.1,17.78 40.89,17.98 Y402.1 40.84,17.93 40.74,17.83 38.89,17.83 U401.5
RX0/PWMG  (via drill 0.33)
  Top 0.152: v30.35,31.17 27.41,28.22 26.92,28.22 R422.2 | v36.5,27.56 35.03,26.09 U401.21
  Bottom 0.152: 30.35,31.73 30.35,33.63 29.84,34.14 29.84,36.2 J401.4 | 30.35,31.73 v30.35,31.17 | v36.5,27.56 36.25,27.56 34.92,28.88 34.92,29.13 32.33,31.73 30.35,31.73
RX1  (via drill 0.33)
  Top 0.152: v17.58,31.85 17.6,31.83 18.44,31.83 18.47,31.85 19,31.85 U502.7 | v26.01,24.03 26.64,23.39 26.64,23.06 27,22.71 27.58,22.71 27.66,22.78 U401.34 | v40.89,23.7 37.95,23.7 v35.23,20.98 | v28.98,19.94 v30.02,20.98
  Bottom 0.152: v17.58,31.85 17.96,31.85 17.98,31.83 18.21,31.83 v26.01,24.03 28.09,21.95 28.09,21.21 28.98,20.32 v28.98,19.94 | J404.6 54.61,6.1 57.81,9.3 53.37,13.74 53.37,14.78 46.58,21.57 43,21.57 40.89,23.67 v40.89,23.7 | v30.02,20.98 v35.23,20.98
RX_I
  Top 0.152: J501.RX 19.06,34.28 19.41,33.93 U502.4
SCK0  (via drill 0.33)
  Top 0.152: v13.54,26.82 8.1,21.39 7.34,21.39 U701.5 | v30.43,34.37 v22.68,34.37 | v35.51,29.11 33.68,29.11 33.35,28.78 33.35,27.91 33.05,27.61 33.05,27.23 32.51,26.7 32.51,26.44 32.13,26.06 32.13,25.27 U401.27
  Bottom 0.152: v13.54,26.82 13.54,33.3 17.8,37.57 19.48,37.57 v22.68,34.37 | v30.43,34.37 30.43,34.19 v35.51,29.11
SCK1  (via drill 0.33)
  Top 0.152: v25.93,12.95 25.93,14.28 26.64,14.99 26.64,16.05 26.9,16.31 U401.47 | v26.31,11.68 26.31,11.07 J406.6 | J402.4 7.21,1.27 8.38,2.44 9.2,2.44 12.6,5.84 12.6,6.66 13.46,7.52 15.57,7.52 v17.98,9.93
  Bottom 0.152: v25.93,12.95 25.93,12.06 v26.31,11.68 | v17.98,9.93 18.01,9.93 J406.6
SCL0
  Top 0.152: J002.1 35.59,27.96 35.59,27.08 34.54,26.04 34.54,25.17 U401.22
SCL1  (via drill 0.33)
  Top 0.152: v20.93,15.21 20.98,15.27 21.95,15.27 22.1,15.42 22.1,16 22.35,16.26 22.58,16.26 R401.6 | v28.98,21.57 28.73,21.31 27.69,21.31 U401.37 | v32,10.16 32,6.6 J406.2 | J002.3 39.37,35.66 31.6,27.89 31.6,27.36 v31.06,26.82
  Bottom 0.152: v20.93,15.21 21.97,15.21 26.09,11.1 27,11.1 J406.2 | v28.98,21.57 28.98,21.18 29.18,20.98 | 29.18,20.98 30.1,20.07 30.1,14.78 32,12.88 v32,10.16 | v31.06,26.82 31.06,24.89 31.75,24.21 31.75,23.72 32.03,23.44 32.03,22.99 31.42,22.38 31.24,22.55 30.76,22.55 29.18,20.98
SDA0  (via drill 0.33)
  Top 0.152: v32.51,23.85 32.51,25.15 U401.26 | v32.41,27.46 32.41,28.27 33.55,29.41 34.49,29.41 J002.2
  Bottom 0.152: v32.51,23.85 32.51,27.36 v32.41,27.46
SDA1/BSL  (via drill 0.33)
  Top 0.152: v26.34,19.41 27.58,19.41 27.66,19.33 U401.41 | R401.8 22.61,17.32 22.61,18.26 v23.75,19.41 24.66,20.32 24.66,20.65 24.69,20.68 24.69,25.93 25.3,26.54 26.42,25.43 27.2,25.43 36.83,35.05 J401.1
  Bottom 0.152: v26.34,19.41 25.78,19.41 | 25.78,19.41 v23.75,19.41 | 25.78,19.41 25.78,15.6 27.1,14.28 27.1,13.54 J406.1
TX0/PWMB  (via drill 0.33)
  Top 0.152: R422.3 26.9,28.7 26.67,28.7 26.42,28.96 26.42,29.54 31.75,34.87 J401.3 | v37.08,28.65 37.08,27.33 36.04,26.29 36.04,25.17 U401.19
  Bottom 0.152: v37.08,28.65 37.08,31.5 J401.3
TX1/PWMR  (via drill 0.33)
  Top 0.152: 32.05,31.09 30.99,32.16 30.53,32.16 27.64,29.26 R422.4 | 32.05,31.09 v27.18,26.21 26.54,26.85 25.17,26.85 24.41,26.09 23.55,26.09 23.19,25.73 v19.66,25.73 | v28.85,24.13 28.5,24.13 27.69,23.32 U401.33 | v16.28,28.35 19.41,31.47 U502.8 | v32.11,31.14 32.05,31.09
  Bottom 0.152: v27.18,26.21 27.18,25.81 v28.85,24.13 | v16.28,28.35 16.31,28.35 16.89,27.76 17.63,27.76 v19.66,25.73 | J404.5 52.07,3.99 55.02,6.93 46.97,14.99 46.97,15.06 46.91,15.11 46.91,15.16 46.89,15.19 46.89,15.24 46.86,15.27 46.86,16.92 37.92,25.86 37.39,25.86 v32.11,31.14
TX_O
  Top 0.152: J501.TX 18.56,34.27 19.01,33.82 U502.5
USB_ON  (via drill 0.33)
  Top 0.152: v46.86,30.33 49.53,32.99 49.78,32.99 R015.2 | v48.77,21.74 48.77,19.96 48.62,19.81 S010.P$1 48.54,19.76 47.73,18.95 47.73,17.75 44.68,14.71 44.25,14.71 43.03,13.49 v41.1,13.49 | v36.88,17.2 35.41,15.72 35.08,15.72 34.37,15.01 34.29,15.01 34.04,14.76 34.04,13.97 U401.58
  Bottom 0.152: v46.86,30.33 46.86,27.76 45.77,26.67 46.13,26.31 46.13,25.93 48.46,23.6 48.46,22.05 v48.77,21.74 | v36.88,17.2 37.39,17.2 v41.1,13.49
USB_SOFTCONNECT
  Top 0.152: R015.8 50.8,33.78 50.93,33.91 50.93,36.25 Q050.1 50.88,36.3 49.91,37.26 48.87,37.26 37.03,25.43 37.03,25.17 U401.17
USBD+
  Top 0.152: C023.1 50.62,24.89 50.67,24.94 50.29,25.32 50.29,26.11 49.94,26.47 49.81,26.47 R023.3 49.73,26.44 47.88,26.44 47.8,26.36 46.63,26.36 45.77,25.5 45.16,25.5 42.34,22.68 42.04,22.68 39.78,20.42 38.99,20.42 38.89,20.32 U401.10
USBD-  (via drill 0.33)
  Top 0.152: R023.4 49.81,25.83 49.96,25.68 49.96,24.89 C023.2 49.89,24.89 48.92,24.89 v47.3,23.27 | v42.11,23.27 39.75,20.9 38.96,20.9 38.89,20.83 U401.11
  Bottom 0.152: v42.11,23.27 v47.3,23.27
VBUS  (via drill 0.33)
  Top 0.152: v44.04,8.89 43.99,8.84 43.99,8.13 R201.5 | v51.94,27.84 51.38,28.4 50.8,28.4 R053.5 | v51.56,32.89 51.23,33.22 51.13,33.12 50.9,33.12 R015.7 | C302.1 45.54,18.57 45.54,19.81 D302.1 45.54,19.89 45.54,22.68 | 45.54,22.68 45.54,24.59 U301.4 | 51.94,24.36 50.9,24.36 50.88,24.38 49.23,24.38 47.52,22.68 45.54,22.68 | 51.94,24.36 56.84,24.36 J001.1 | v51.94,24.41 51.94,24.36 | v44.73,9.86 45.74,10.87 45.74,11.99 46.51,12.75 46.51,16.1 v50.67,20.27
  Bottom 0.152: J404.2 44.04,1.68 v44.04,8.89 44.09,8.94 44.09,9.22 v44.73,9.86 | v51.56,32.89 51.94,32.51 v51.94,27.84 v51.94,24.41 50.67,23.14 v50.67,20.27
VCC  (via drill 0.33)
  Top 0.152: J406.11 12.68,10.13 | 12.68,10.13 18.36,15.82 21.57,15.82 R401.4 21.61,15.72 21.61,16.26 R401.3 21.61,16.33 21.61,16.74 R401.2 21.61,16.82 21.61,17.3 R401.1 21.61,17.37 21.61,17.6 v22.02,18.01 | 23.65,25.07 23.65,24.08 U402.1 | 23.65,25.07 23.98,25.4 C432.1 | 17.42,26.34 18.64,25.12 23.6,25.12 23.65,25.07 | 17.42,26.34 18.01,26.92 18.19,26.92 19.38,28.12 19.38,28.45 19.58,28.65 S401.2 19.63,28.7 19.63,29.11 20.6,30.07 U502.11 20.68,31.85 22.1,33.27 22.1,34.59 24.13,36.63 J401.6 | 6.22,27.18 6.22,31.73 8.64,34.14 C501.1 | 6.22,27.18 C701.1 6.17,27.58 | U501.3 10.11,33.86 8.46,33.86 C501.1 | 6.93,20.27 7.11,20.27 U701.4 | 17.42,26.34 17.37,26.39 16.84,26.39 15.52,27.71 15.24,27.71 13.77,26.24 13.69,26.24 8.18,20.73 7.59,20.73 7.19,20.32 U701.4 | 12.68,10.13 4.75,18.06 6.91,20.22 U701.4 | 47.85,35.05 49.33,33.58 R015.1 | 47.85,35.05 49.35,36.55 Q050.2 | v37.69,25.27 47.42,35 47.8,35 47.85,35.05 | v35,27.3 34.31,27.3 34.09,27.08 C423.1 34.04,25.17 U401.23 33.98,25.09 33.98,23.82 28.57,18.41 27.81,18.41 27.74,18.34 U401.43 27.66,18.29 C443.1 25.22,18.26 24.36,17.4 v23.37,17.4 | C451.1 30.48,13.92 30.5,13.95 U401.51 30.56,14.02 30.63,14.1 30.63,14.63 30.5,14.76 | 30.5,14.76 30.25,15.01 29.79,15.01 29.54,14.76 29.54,13.97 U401.49 | 37.57,18.8 36.75,18.8 34.24,16.28 32.03,16.28 30.5,14.76 | 37.57,18.8 38.86,18.8 U401.7 38.94,18.85 39.01,18.92 39.78,18.92 41.25,20.4 v41.25,21.06 | U401.63 36.63,14.07 36.63,14.86 37.03,15.27 37.41,14.88 37.41,13.97 39.04,12.34 39.12,12.34 C463.1 39.17,12.39 41.15,14.38 | 41.15,14.38 42.6,15.82 42.72,15.82 42.98,16.08 42.98,18.24 42.29,18.92 C407.1
  Top 0.152: v48.01,7.59 48.01,7.77 48.39,8.15 48.62,8.15 49,8.53 U202.3 49.21,8.57 49.78,9.14 55.88,9.14 55.88,8.64 57.18,8.64 U201.5 57.18,7.62 59.94,7.62 C205.1 | v41.2,14.33 41.15,14.38 | v37.57,18.59 37.57,18.8 | 6.22,27.18 6.35,27.05 6.35,23.37 6.1,23.11 6.1,21.08 6.91,20.27 U701.4 | C501.1 8.64,34.8 9.35,34.8 9.35,35.26 9.84,35.75 U501.1
  Bottom 0.152: v35,27.3 37.03,25.27 v37.69,25.27 37.74,25.22 37.74,24.56 v41.25,21.06 | J404.3 46.99,5.56 48.51,7.09 v48.01,7.59 45.92,9.68 45.72,9.68 41.2,14.2 v41.2,14.33 37.57,17.96 v37.57,18.59 | v22.02,18.01 22.76,18.01 v23.37,17.4
VIN+  (via drill 0.33)
  Top 0.152: D302.3 46.48,21.11 v46.35,20.98 | v48.82,15.9 48.82,9.53 48.26,8.97 48.26,8.87 47.02,7.62 U202.5 | 45.07,6.97 R203.1
  Top 0.457: U202.5 45.72,7.62 45.07,6.97
  Bottom 0.152: v46.35,20.98 46.35,18.36 v48.82,15.9
VIN-  (via drill 0.33)
  Top 0.152: U201.1 54.56,8.56 54.28,8.28 C201.1 53.03,8.23 51.23,8.23 v50.11,7.11 | 43.43,8.89 43.43,9.98 43.61,10.16 | 43.43,8.89 R201.6 | 43.61,10.16 44.91,11.46 S201.1 | 43.61,10.16 44.63,9.14 44.63,9.09 44.91,8.81 44.91,8.33 R203.2 44.96,8.38 | v47.5,8.91 46.81,8.91 46.51,8.61 U202.4 46.45,8.38 | 43.43,8.89 v43.2,8.89
  Top 0.457: 46.45,8.38 44.96,8.38
  Bottom 0.152: v50.11,7.11 49.3,7.11 v47.5,8.91 | J404.1 41.91,4.88 43.74,6.71 43.74,8.36 v43.2,8.89
VLIPO  (via drill 0.33)
  Top 0.152: v48.16,21.16 47.45,20.45 47.45,19.84 D302.2 | v45.54,26.09 45.54,27.2 U301.3 45.54,27.28 45.82,27.56 C301.1 | v53.95,13.97 J301.2
  Bottom 0.152: v45.54,26.09 48.16,23.47 v48.16,21.16 53.95,15.37 v53.95,13.97
XTAL1
  Top 0.152: C462.2 37.85,12.34 36.42,12.34 Y401.1 36.4,12.42 36.04,12.78 36.04,13.95 U401.62
XTAL2
  Top 0.152: C461.2 33.27,11.05 34.7,11.05 Y401.3 34.77,11.07 35.28,11.58 35.38,11.58 35.56,11.76 35.56,12.93 35.53,12.95 35.53,13.95 U401.61

### Text on the board
tPlace: VCC | GND | RX0 | TX0 | RST | BSL | SDA1 | SCL1 | SCL0 | SDA0 | CHARGE | USB | Boot | On | Stop/BSL | Reset | GND | 11DoF | MISO1 | SCK1 | MOSI1 | CS1 | GND | AD8 | AD7 | AD6 | AD5 | AD4 | AD3 | AD2 | AD1 | PPS | VBAT | VBUS | VCC | GND | TX1 | RX1
bPlace: VCC | GND | RX0 | TX0 | RST | BSL | SDA1 | SCL1 | SCL0 | SDA0 | Project Candace | St Kwan's Home for | the Terminally ADD | Loginator v3 | a division of Kwan Systems | stkwans.blogspot.com | 01 Apr 2013 | GND | VCC | CSA | IA | MISO | MOSI | SCK | IG | CSG | CI | SCL1 | SDA1 | 11DoF | MISO1 | SCK1 | MOSI1 | CS1 | GND | AD8 | AD7 | AD6 | AD5 | AD4 | AD3 | AD2 | AD1 | PPS | VBAT | VBUS | VCC | GND | TX1 | RX1
Document: Released under the Creative Commons Attribution Share-Alike 3.0 License | http://creativecommons.org/licenses/by-sa/3.0 | Original design by C. Taylor and N. Seidle, Sparkfun Electronics http://www.sparkfun.com/products/10216 | Heavily modified by C. Jeppesen, St Kwan's Home for the Terminally ADD, stkwans.blogspot.com